# EAGLE design BabyPC (EAGLE 9.2.0)
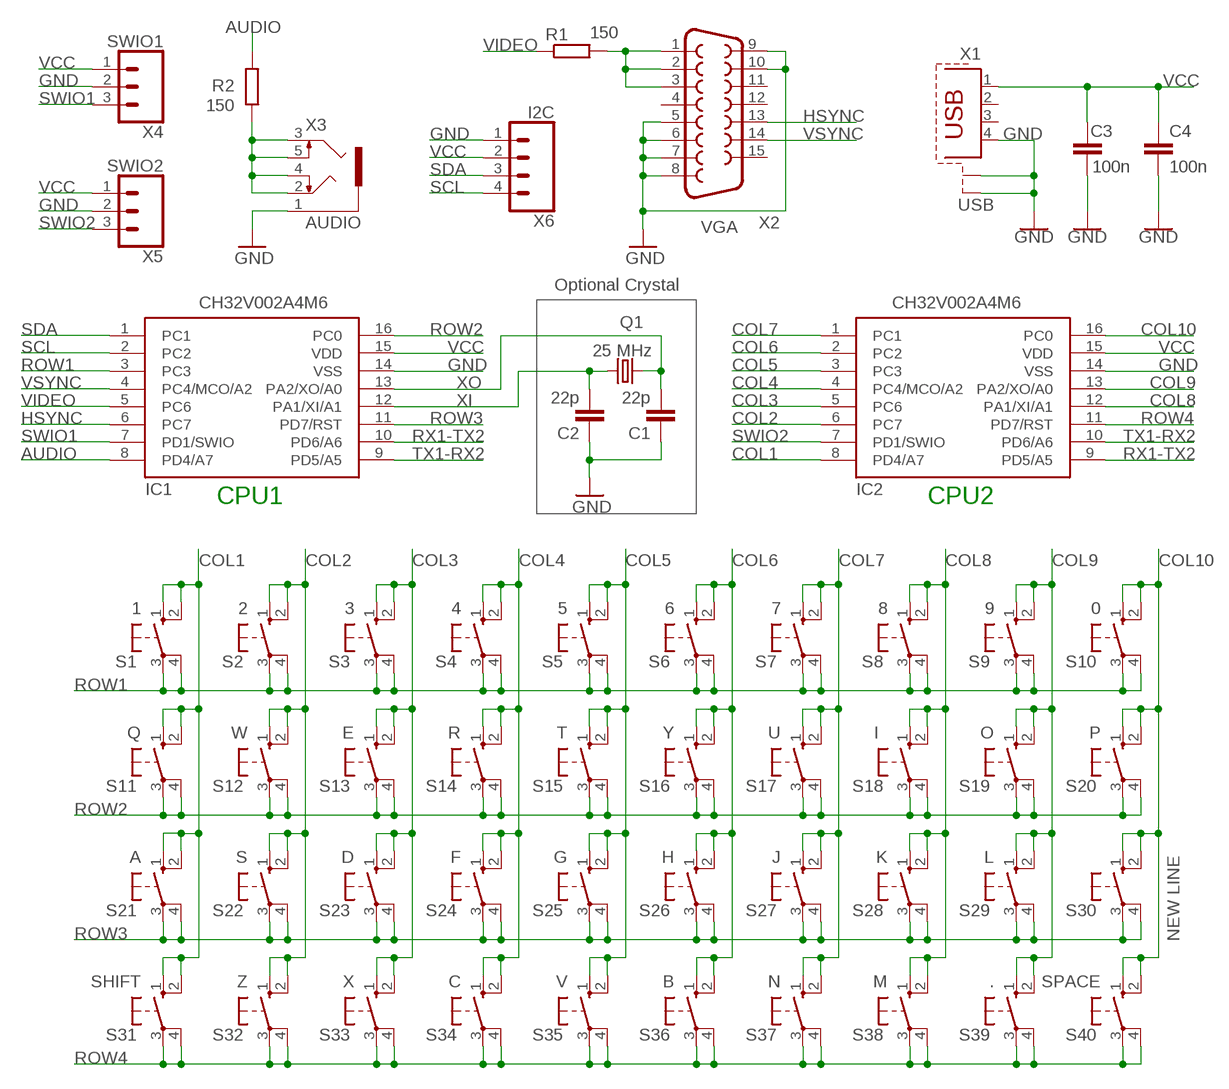
[diagram p0: schematic, sheet 1]

## Parts
C1  22p  C-EU050-024X044  [C050-024X044]
C2  22p  C-EU050-024X044  [C050-024X044]
C3  100n  C-EU050-024X044  [C050-024X044]
C4  100n  C-EU050-024X044  [C050-024X044]
IC1  CH32V002A4M6  [SOP16]
IC2  CH32V002A4M6  [SOP16]
Q1  25 MHz  CRYSTALHC49U-V  [HC49U-V]
R1  150  R-EU_0204/7  [0204/7]
R2  150  R-EU_0204/7  [0204/7]
S1  1  10-XX  [B3F-10XX]
S2  2  10-XX  [B3F-10XX]
S3  3  10-XX  [B3F-10XX]
S4  4  10-XX  [B3F-10XX]
S5  5  10-XX  [B3F-10XX]
S6  6  10-XX  [B3F-10XX]
S7  7  10-XX  [B3F-10XX]
S8  8  10-XX  [B3F-10XX]
S9  9  10-XX  [B3F-10XX]
S10  0  10-XX  [B3F-10XX]
S11  Q  10-XX  [B3F-10XX]
S12  W  10-XX  [B3F-10XX]
S13  E  10-XX  [B3F-10XX]
S14  R  10-XX  [B3F-10XX]
S15  T  10-XX  [B3F-10XX]
S16  Y  10-XX  [B3F-10XX]
S17  U  10-XX  [B3F-10XX]
S18  I  10-XX  [B3F-10XX]
S19  O  10-XX  [B3F-10XX]
S20  P  10-XX  [B3F-10XX]
S21  A  10-XX  [B3F-10XX]
S22  S  10-XX  [B3F-10XX]
S23  D  10-XX  [B3F-10XX]
S24  F  10-XX  [B3F-10XX]
S25  G  10-XX  [B3F-10XX]
S26  H  10-XX  [B3F-10XX]
S27  J  10-XX  [B3F-10XX]
S28  K  10-XX  [B3F-10XX]
S29  L  10-XX  [B3F-10XX]
S30  NEW LINE  10-XX  [B3F-10XX]
S31  SHIFT  10-XX  [B3F-10XX]
S32  Z  10-XX  [B3F-10XX]
S33  X  10-XX  [B3F-10XX]
S34  C  10-XX  [B3F-10XX]
S35  V  10-XX  [B3F-10XX]
S36  B  10-XX  [B3F-10XX]
S37  N  10-XX  [B3F-10XX]
S38  M  10-XX  [B3F-10XX]
S39  .  10-XX  [B3F-10XX]
S40  SPACE  10-XX  [B3F-10XX]
X1  USB  PN61729-S  [PN61729-S]
X2  VGA  F15HDH  [HDF15H]
X3  AUDIO  1503_09  [1503_09]
X4  SWIO1  CONN_03LONGPADS  [1X03_LONGPADS]
X5  SWIO2  CONN_03LONGPADS  [1X03_LONGPADS]
X6  I2C  CONN_04LONGPADS  [1X04_LONGPADS]

## Nets
AUDIO: IC1.8(PD4/A7) R2.2
COL1: IC2.8(PD4/A7) S1.1(S) S1.2(S1) S11.1(S) S11.2(S1) S21.1(S) S21.2(S1) S31.1(S) S31.2(S1)
COL2: IC2.6(PC7) S2.1(S) S2.2(S1) S12.1(S) S12.2(S1) S22.1(S) S22.2(S1) S32.1(S) S32.2(S1)
COL3: IC2.5(PC6) S3.1(S) S3.2(S1) S13.1(S) S13.2(S1) S23.1(S) S23.2(S1) S33.1(S) S33.2(S1)
COL4: IC2.4(PC4/MCO/A2) S4.1(S) S4.2(S1) S14.1(S) S14.2(S1) S24.1(S) S24.2(S1) S34.1(S) S34.2(S1)
COL5: IC2.3(PC3) S5.1(S) S5.2(S1) S15.1(S) S15.2(S1) S25.1(S) S25.2(S1) S35.1(S) S35.2(S1)
COL6: IC2.2(PC2) S6.1(S) S6.2(S1) S16.1(S) S16.2(S1) S26.1(S) S26.2(S1) S36.1(S) S36.2(S1)
COL7: IC2.1(PC1) S7.1(S) S7.2(S1) S17.1(S) S17.2(S1) S27.1(S) S27.2(S1) S37.1(S) S37.2(S1)
COL8: IC2.12(PA1/XI/A1) S8.1(S) S8.2(S1) S18.1(S) S18.2(S1) S28.1(S) S28.2(S1) S38.1(S) S38.2(S1)
COL9: IC2.13(PA2/XO/A0) S9.1(S) S9.2(S1) S19.1(S) S19.2(S1) S29.1(S) S29.2(S1) S39.1(S) S39.2(S1)
COL10: IC2.16(PC0) S10.1(S) S10.2(S1) S20.1(S) S20.2(S1) S30.1(S) S30.2(S1) S40.1(S) S40.2(S1)
GND: C1.1 C2.1 C3.1 C4.2 IC1.14(VSS) IC2.14(VSS) X1.4 X1.S1 X1.S2 X2.5 X2.6 X2.7 X2.8 X2.9 X2.10 X3.1 X4.2 X5.2 X6.1
HSYNC: IC1.6(PC7) X2.13
N$7: R2.1 X3.2 X3.3 X3.4 X3.5
N$14: R1.2 X2.1 X2.2 X2.3
ROW1: IC1.3(PC3) S1.3(P) S1.4(P1) S2.3(P) S2.4(P1) S3.3(P) S3.4(P1) S4.3(P) S4.4(P1) S5.3(P) S5.4(P1) S6.3(P) S6.4(P1) S7.3(P) S7.4(P1) S8.3(P) S8.4(P1) S9.3(P) S9.4(P1) S10.3(P) S10.4(P1)
ROW2: IC1.16(PC0) S11.3(P) S11.4(P1) S12.3(P) S12.4(P1) S13.3(P) S13.4(P1) S14.3(P) S14.4(P1) S15.3(P) S15.4(P1) S16.3(P) S16.4(P1) S17.3(P) S17.4(P1) S18.3(P) S18.4(P1) S19.3(P) S19.4(P1) S20.3(P) S20.4(P1)
ROW3: IC1.11(PD7/RST) S21.3(P) S21.4(P1) S22.3(P) S22.4(P1) S23.3(P) S23.4(P1) S24.3(P) S24.4(P1) S25.3(P) S25.4(P1) S26.3(P) S26.4(P1) S27.3(P) S27.4(P1) S28.3(P) S28.4(P1) S29.3(P) S29.4(P1) S30.3(P) S30.4(P1)
ROW4: IC2.11(PD7/RST) S31.3(P) S31.4(P1) S32.3(P) S32.4(P1) S33.3(P) S33.4(P1) S34.3(P) S34.4(P1) S35.3(P) S35.4(P1) S36.3(P) S36.4(P1) S37.3(P) S37.4(P1) S38.3(P) S38.4(P1) S39.3(P) S39.4(P1) S40.3(P) S40.4(P1)
RX1-TX2: IC1.10(PD6/A6) IC2.9(PD5/A5)
SCL: IC1.2(PC2) X6.4
SDA: IC1.1(PC1) X6.3
SWIO1: IC1.7(PD1/SWIO) X4.3
SWIO2: IC2.7(PD1/SWIO) X5.3
TX1-RX2: IC1.9(PD5/A5) IC2.10(PD6/A6)
VCC: C3.2 C4.1 IC1.15(VDD) IC2.15(VDD) X1.1 X4.1 X5.1 X6.2
VIDEO: IC1.5(PC6) R1.1
VSYNC: IC1.4(PC4/MCO/A2) X2.14
XI: C2.2 IC1.12(PA1/XI/A1) Q1.2
XO: C1.2 IC1.13(PA2/XO/A0) Q1.1
Unconnected: X1.2 X1.3 X2.4 X2.11 X2.12 X2.15

## Notes on the sheet
- Optional Crystal
- CPU1 | CPU2

## Library data of the parts
C1-C4 = rcl:C-EU: CAPACITOR, European symbol; SPICEPREFIX: C
IC1 IC2 = CH32V:CH32V002A4M6
Q1 = crystal:CRYSTAL: CRYSTAL; OC_FARNELL: 1666969; OC_NEWARK: unknown
R1 R2 = rcl:R-EU_: RESISTOR, European symbol; SPICEPREFIX: R
S1-S40 = switch-omron2:10-XX: OMRON SWITCH; MPN: B3F-1000; OC_FARNELL: 176432; OC_NEWARK: 36M3542
X1 = con-berg:PN61729-S: BERG USB connector; OC_FARNELL: unknown; OC_NEWARK: unknown
X2 = adafruit_B:F15: SUB-D HDH is also known as a 'right angle VGA' connector
X3 = con-lumberg:1503_09: Jack connectors according to JISC 6560, 3.5 mm Klinkeneinbaukupplung nach JISC 6560, 3,5 mm, 3-polig/ stereo, abgewinkelte Ausführung, mit 2 Öffnern und Lötaugen, für Leiterplatten Rückseitenmontage Source: http://www.lumberg.com/Produkte/PDFs/1503_09.pdf; OC_FARNELL: 1243244; OC_NEWARK: unknown
X4 X5 = SparkFun-Connectors:CONN_03: Multi connection point. Often used as Generic Header-pin footprint for 0.1 inch spaced/style header connections On any of the 0.1 inch spaced packages, you can populate with these: Break Away Headers - Straight <https://www.sparkfun.com/products/116> (PRT-00116) Break Away Male Headers - Right Angle <https://www.sparkfun.com/products/553> (PRT-00553) Female Headers <https://www.sparkfun.com/products/115> (PRT-00115) Break Away Headers - Machine Pin <https://www.sparkfun.com/products/117> (PRT-00117) Break Away Female Headers - Swiss Machine Pin <https://www.sparkfun.com/products/743> (PRT-00743) Stackable Header - 3 Pin (Female, 0.1") <https://www.sparkfun.com/products/13875> (PRT-13875) For SCREWTERMINALS and SPRING TERMINALS visit here: Screw Terimnals on SparkFun.com <https://www.sparkfun.com/search/results?term=Screw+Terminals> (5mm/3.5mm/2.54mm spacing) This device is also useful as a general connection point to wire up your design to another part of your project. Our various solder wires solder well into these plated through hole pads. Hook-Up Wire - Assortment (Stranded, 22 AWG) <https://www.sparkfun.com/products/11375> (PRT-11375) Hook-Up Wire - Assortment (Solid Core, 22 AWG) <https://www.sparkfun.com/products/11367> (PRT-11367) View the entire wire category on our website here <https://www.sparkfun.com/categories/141> Special notes: Molex polarized connector foot print use with SKU : PRT-08232 with associated crimp pins and housings.
X6 = SparkFun-Connectors:CONN_04: Multi connection point. Often used as Generic Header-pin footprint for 0.1 inch spaced/style header connections On any of the 0.1 inch spaced packages, you can populate with these: Break Away Headers - Straight <https://www.sparkfun.com/products/116> (PRT-00116) Break Away Male Headers - Right Angle <https://www.sparkfun.com/products/553> (PRT-00553) Female Headers <https://www.sparkfun.com/products/115> (PRT-00115) Break Away Headers - Machine Pin <https://www.sparkfun.com/products/117> (PRT-00117) Break Away Female Headers - Swiss Machine Pin <https://www.sparkfun.com/products/743> (PRT-00743) For SCREWTERMINALS and SPRING TERMINALS visit here: Screw Terimnals on SparkFun.com <https://www.sparkfun.com/search/results?term=Screw+Terminals> (5mm/3.5mm/2.54mm spacing) This device is also useful as a general connection point to wire up your design to another part of your project. Our various solder wires solder well into these plated through hole pads. Hook-Up Wire - Assortment (Stranded, 22 AWG) <https://www.sparkfun.com/products/11375> (PRT-11375) Hook-Up Wire - Assortment (Solid Core, 22 AWG) <https://www.sparkfun.com/products/11367> (PRT-11367) View the entire wire category on our website here <https://www.sparkfun.com/categories/141> Special notes: Molex polarized connector foot print use with SKU : PRT-08231 with associated crimp pins and housings. 1MM SMD Version SKU: PRT-10208; PROD_ID: CONN-09696

## Board
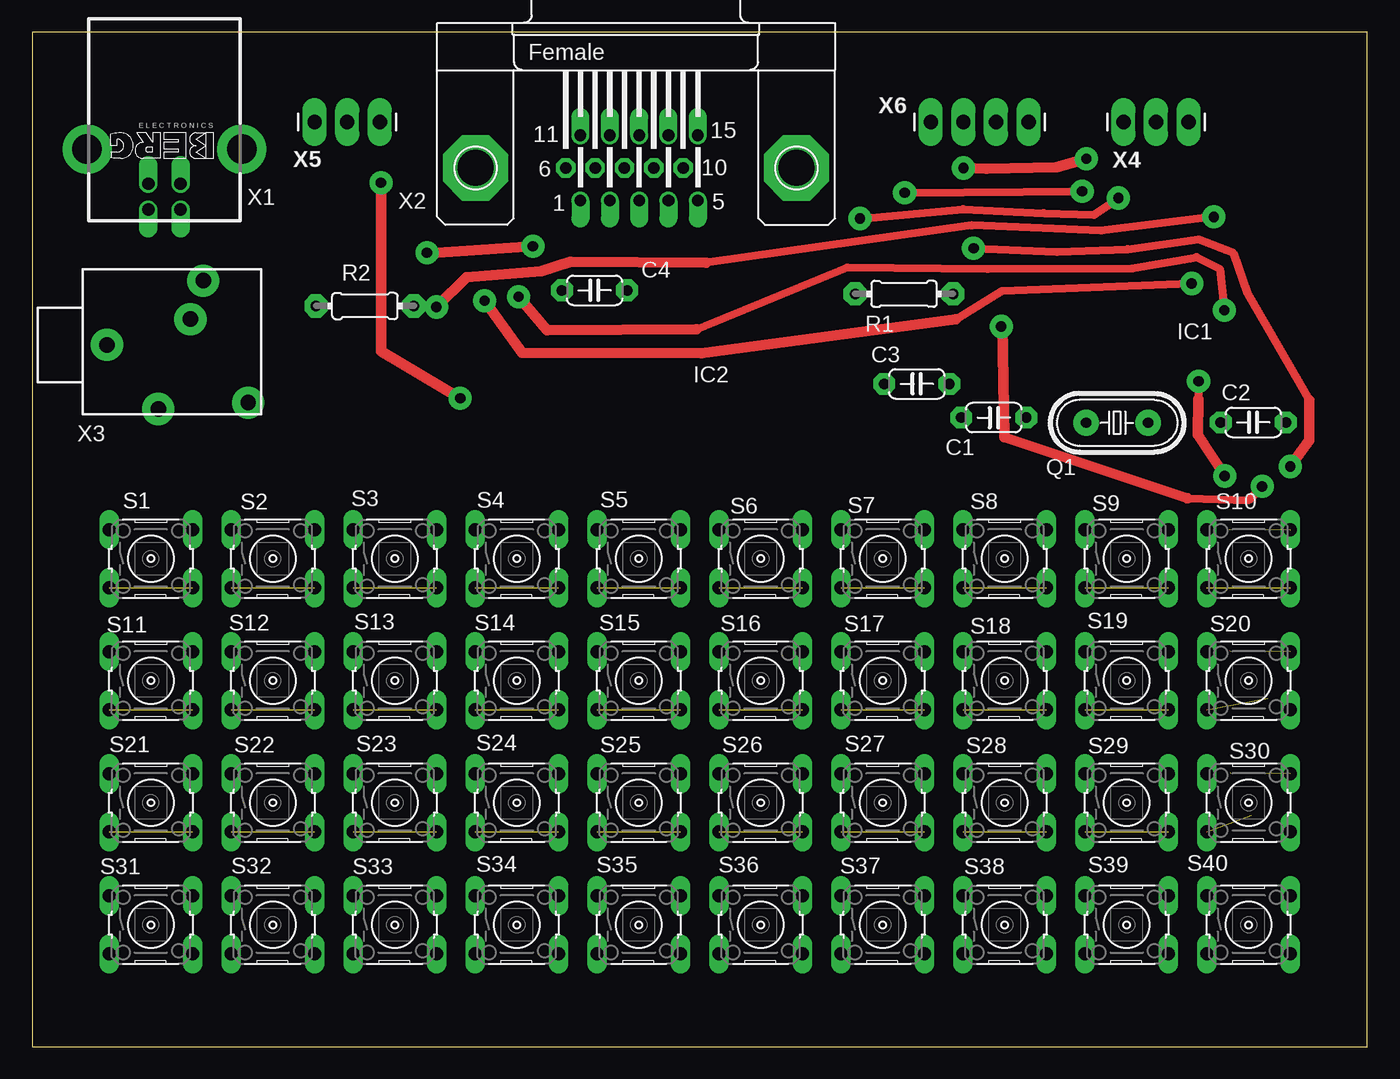
[diagram p1: board, top side]
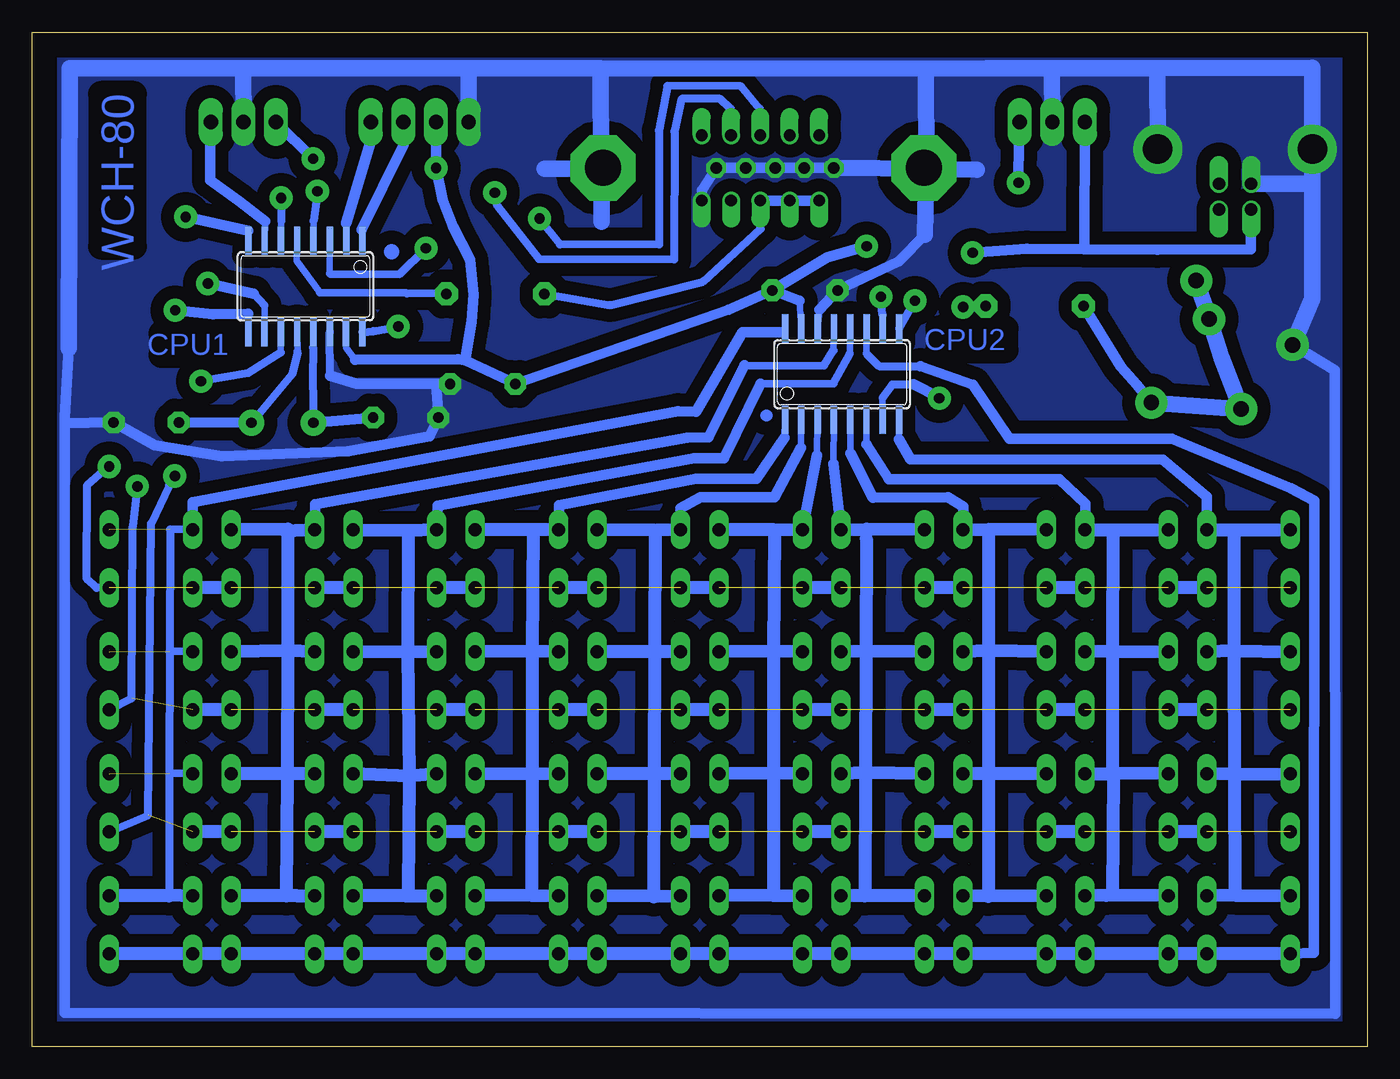
[diagram p2: board, bottom side, seen from below]

Size 104 x 79 mm. Coordinates in mm from the lower left corner, seen from the top.
Outline: 0,0 104,0 104,79 0,79 0,0
Copper layers (1*16): Top 0.035mm / dielectric 1.5mm / Bottom 0.035mm
Design rules "default": minimum track width 6mil, minimum drill 0.35mm, track to track 6mil, track to pad 6mil, pad to pad 6mil, via to via 6mil, smd to smd 6mil, copper to edge 40mil, drill to drill 6mil, minimum pad ring 10mil, minimum via ring 8mil, stop-mask expansion 4mil, vias tented up to drill 0mil, thermal gap 10mil

### Footprints (pad centres in the part's own frame; a part is rotated, then mirrored left to right if it is on the bottom)
C050-024X044 = drill 0.813 pad 1.7 octagon: 1 -2.54,0; 2 2.54,0
SOP16 = smd 0.5 x 2.2: 1 -4.445,-3.55; 2 -3.185,-3.55; 3 -1.915,-3.55; 4 -0.645,-3.55; 5 0.635,-3.55; 6 1.895,-3.55; 7 3.165,-3.55; 8 4.435,-3.55; 9 4.445,3.55; 10 3.175,3.55; 11 1.905,3.55; 12 0.635,3.55; 13 -0.635,3.55; 14 -1.905,3.55; 15 -3.175,3.55; 16 -4.445,3.55
HC49U-V = drill 0.813 pad 2: 1 -2.413,0; 2 2.413,0
0204/7 = drill 0.813 pad 1.8 octagon: 1 -3.81,0; 2 3.81,0
B3F-10XX = drill 1.016 long: 1 -3.251,2.261; 2 3.251,2.261; 3 -3.251,-2.261; 4 3.251,-2.261
PN61729-S = drill 0.95 offset: 1 1.25,4.71; 2 -1.25,4.71; 3 -1.25,2.71; 4 1.25,2.71 | drill 2.3 pad 3.81: S1 -6.02,0; S2 6.02,0
HDF15H = drill 0.9 pad 1.27 offset: 1 4.329,2.54; 2 2.043,2.54; 3 -0.243,2.54; 4 -2.529,2.54; 5 -4.815,2.54; 11 4.329,-2.54; 12 2.043,-2.54; 13 -0.243,-2.54; 14 -2.529,-2.54; 15 -4.815,-2.54 | drill 0.9 pad 1.5 octagon: 6 5.472,0; 7 3.186,0; 8 0.9,0; 9 -1.386,0; 10 -3.672,0 | drill 2.8 pad 5.08 octagon: P$1 -12.5,0; P$2 12.5,0
1503_09 = drill 1.2 pad 2.5: 1 0,-2; 2 -5,-6; 3 5,-9.5; 4 -4.5,-13; 5 2,-8.5
1X03_LONGPADS = drill 1.118 pad 1.88 long: 1 0,0; 2 2.54,0; 3 5.08,0
1X04_LONGPADS = drill 1.118 pad 1.88 long: 1 0,0; 2 2.54,0; 3 5.08,0; 4 7.62,0

### Placement (x,y rotation side)
C1  74.9,48.99 0 top
C2  95.12,48.61 180 top
C3  68.9,51.61 180 top
C4  43.81,58.9 180 top
IC1  82.72,59.2 180 bottom
IC2  40.91,52.37 0 bottom
Q1  84.5,48.58 0 top
R1  67.91,58.62 180 top
R2  25.93,57.68 0 top
S1  9.25,38 0 top
S2  18.75,38 0 top
S3  28.25,38 0 top
S4  37.75,38 0 top
S5  47.25,38 0 top
S6  56.75,38 0 top
S7  66.25,38 0 top
S8  75.75,38 0 top
S9  85.25,38 0 top
S10  94.75,38 0 top
S11  9.25,28.5 0 top
S12  18.75,28.5 0 top
S13  28.25,28.5 0 top
S14  37.75,28.5 0 top
S15  47.25,28.5 0 top
S16  56.75,28.5 0 top
S17  66.25,28.5 0 top
S18  75.75,28.5 0 top
S19  85.25,28.5 0 top
S20  94.75,28.5 0 top
S21  9.25,19 0 top
S22  18.75,19 0 top
S23  28.25,19 0 top
S24  37.75,19 0 top
S25  47.25,19 0 top
S26  56.75,19 0 top
S27  66.25,19 0 top
S28  75.75,19 0 top
S29  85.25,19 0 top
S30  94.75,19 0 top
S31  9.25,9.5 0 top
S32  18.75,9.5 0 top
S33  28.25,9.5 0 top
S34  37.75,9.5 0 top
S35  47.25,9.5 0 top
S36  56.75,9.5 0 top
S37  66.25,9.5 0 top
S38  75.75,9.5 0 top
S39  85.25,9.5 0 top
S40  94.75,9.5 0 top
X1  10.31,69.89 180 top
X2  47.04,68.43 180 top
X3  3.83,54.65 90 top
X4  85,72 0 top
X5  22,72 0 top
X6  70,72 0 top

### Tracks (layer width: path | path; a pad name or v marks a point on that pad's centre or on a via)
AUDIO  (via drill 0.8 pad 1.8)
  Top 0.61: v92.04,64.61 83.25,63.54 73.2,63.95 52.49,61.05
  Top 0.813: 52.49,61.05 41.95,61.13 39.64,60.37 33.83,59.91 v31.49,57.6
  Bottom 0.508: IC1.8 87.17,63.52
  Bottom 0.813: 87.17,63.52 v92.04,64.61 | v31.49,57.6 R2.2
COL1
  Bottom 0.508: IC2.8 36.49,47.31
  Bottom 0.813: 36.49,47.31 35.58,45.74 15.92,45.71 12.52,42.84 S1.2
  Bottom 1.016: S1.2 10.41,40.25 | 10.41,40.25 10.41,30.83 | 10.41,30.83 10.38,21.23 | 10.38,21.23 10.33,11.8 | 10.33,11.8 S31.2 | 10.38,21.23 S21.2 | 10.41,30.83 S11.2 | 10.41,40.25 S1.1 | 10.41,30.83 S11.1 | 10.38,21.23 S21.1 | 10.33,11.8 S31.1
COL2
  Bottom 0.508: IC2.6 39.03,46.91
  Bottom 0.61: 19.86,21.3 19.8,21.25 | 19.86,11.8 20.34,11.79 | 15.97,30.75 S12.1
  Bottom 0.813: 39.03,46.91 37.28,44.19 24,44.19 21.96,42.28 S2.2
  Bottom 1.016: S2.2 19.83,40.25 | 19.83,40.25 19.88,30.8 | 19.88,30.8 19.86,21.3 S22.1 | 19.86,11.8 19.8,21.25 S22.2 | S32.2 20.34,11.79 S32.1 | 19.88,30.8 S12.2 | 19.83,40.25 S2.1 | 19.88,30.8 15.97,30.75
COL3
  Bottom 0.508: IC2.5 40.28,46.2
  Bottom 0.61: 31.41,41.01 S3.2
  Bottom 0.813: 40.28,46.2 38.5,42.74 32.68,42.77 31.46,42.06 31.41,41.01
  Bottom 1.016: S3.2 29.51,40.28 | 29.51,40.28 29.52,30.83 | 29.52,30.83 29.52,21.25 | 29.52,21.25 29.53,11.7 | 29.53,11.7 S33.2 | 29.52,21.25 S23.2 | 29.52,30.83 S13.2 | S33.1 29.53,11.7 | S23.1 29.52,21.25 | S13.1 29.52,30.83 | S3.1 29.51,40.28
COL4
  Bottom 0.508: IC2.4 41.57,45.41
  Bottom 0.61: 38.98,40.3 39.03,39.57 | 39.11,21.33 39.09,21.33
  Bottom 0.813: 41.57,45.41 S4.2
  Bottom 1.016: S4.2 38.98,40.3 S4.1 | 39.03,39.57 39.06,30.78 | 39.06,30.78 39.11,21.33 S24.1 | 39.13,11.75 39.09,21.33 S24.2 | 39.13,11.75 S34.2 | 39.06,30.78 S14.2 | S14.1 39.06,30.78 | S34.1 39.13,11.75
COL5
  Bottom 0.508: IC2.3 42.87,46.04
  Bottom 0.61: 46.25,40.23 46.2,40.25
  Bottom 0.813: 42.87,46.04 S5.1
  Bottom 1.016: S5.1 46.25,40.23 | 46.27,30.78 46.2,40.25 S5.2 | 46.27,30.78 46.27,21.3 | 46.27,21.3 46.27,11.78 | 46.27,11.78 S35.1 | S25.1 46.27,21.3 | S15.1 46.27,30.78 | 46.27,11.78 S35.2 | 46.27,21.3 S25.2 | 46.27,30.78 S15.2
COL6
  Bottom 0.508: IC2.2 44.11,46.65
  Bottom 0.61: 55.42,40.2 55.47,40.2 | 55.59,11.68 55.24,11.72
  Bottom 0.813: 44.11,46.65 46.17,42.79 51.94,42.79 53.49,41.93 S6.1
  Bottom 1.016: S6.1 55.42,40.2 | 55.53,30.75 55.47,40.2 S6.2 | 55.53,30.75 55.58,21.26 | 55.58,21.26 55.59,11.68 | S36.1 55.24,11.72 S36.2 | S26.1 55.58,21.26 | S16.1 55.53,30.75 | 55.53,30.75 S16.2 | 55.58,21.26 S26.2
COL7
  Bottom 0.508: IC2.1 45.38,47.41
  Bottom 0.813: 45.38,47.41 47.59,44.24 52.29,44.22 62.96,42.16 S7.1
  Bottom 1.016: S7.1 64.99,40.25 | 64.99,40.25 65.04,30.78 | 65.04,30.78 65.04,21.23 | 65.04,21.23 65.09,11.78 | 65.09,11.78 S37.1 | S27.1 65.04,21.23 | S17.1 65.04,30.78 | 65.09,11.78 S37.2 | 65.04,21.23 S27.2 | 65.04,30.78 S17.2 | 64.99,40.25 S7.2
COL8
  Bottom 0.508: 40.3,53.97 IC2.12
  Bottom 0.61: 47.29,51.63 41.57,51.66 40.3,53.97 | 74.72,11.98 74.97,11.78 | 78.35,40.23 S8.2
  Bottom 0.813: S8.1 72.41,42.13 52.44,45.84 50.11,45.81 47.29,51.63
  Bottom 1.016: S8.1 74.72,40.18 | 74.72,40.18 74.75,30.71 | 74.75,30.71 74.64,21.07 | 74.64,21.07 74.72,11.98 | S38.1 74.97,11.78 S38.2 | S28.1 74.64,21.07 | S18.1 74.75,30.71 | 74.72,40.18 78.35,40.23 | 74.75,30.71 S18.2 | 74.64,21.07 S28.2
COL9
  Bottom 0.508: 41.57,54.22 IC2.13
  Bottom 0.61: 48.51,53.08 42.31,53.03 41.57,54.22 | 84.27,40.15 84.09,40.31 | 84.19,11.75 83.42,11.76
  Bottom 0.813: S9.1 81.96,42.23 53,47.41 51.3,47.47 48.51,53.08
  Bottom 1.016: S9.1 84.27,40.15 | 84.08,30.85 84.09,40.31 S9.2 | 84.08,30.85 84.13,21.27 | 84.13,21.27 84.19,11.75 | S39.1 83.42,11.76 S39.2 | S29.1 84.13,21.27 | S19.1 84.08,30.85 | 84.13,21.27 S29.2 | 84.08,30.85 S19.2
COL10  (3 unrouted)
  Bottom 0.508: 45.59,55.62 IC2.16
  Bottom 0.61: S10.1 93.26,40.28 93.29,30.78 | 93.29,30.78 93.31,21.28 | 93.31,21.28 93.34,11.76 93.31,11.83 | S30.1 93.31,21.28 | S20.1 93.29,30.78
  Bottom 0.813: S10.1 91.48,42.39 53.69,49.5 52.29,49.45 48.66,55.65 45.59,55.62
  Bottom 1.016: 93.31,11.83 S40.1 | 93.34,11.76 S40.2
GND
  Bottom 0.508: IC2.14 42.66,57.4
  Bottom 0.61: 80.79,52.24 IC1.14
  Bottom 0.813: C3.1 72.54,51.61 | 72.54,51.61 78.73,51.61 80.79,52.24 | X2.5 51.84,66.69 X2.10 X2.9 X2.8 X2.7 X2.6 | 42.66,57.4 C4.2 36.49,61.16 34.46,63.24 | X3.1 2.53,52.67 2.51,2.58 101.47,2.63 101.47,48.56 | 101.47,48.56 101.47,49.02 101.16,54.4 | 72.54,51.61 C1.1 73.04,47.52 79.37,46.37 89.22,45.99 94.46,46.83 C2.1 101.47,48.56
  Bottom 1.27: X6.1 70.02,76.19 | 70.02,76.19 87.58,76.19 | 87.58,76.19 101.08,76.19 101.16,54.4 | X4.2 87.58,76.19 | 70.02,76.19 59.73,76.19 | 59.73,76.19 34.38,76.14 | 34.38,76.14 29.69,76.17 24.56,76.19 | 24.56,76.19 16.35,76.19 | 16.35,76.19 X1.S1 | 24.56,76.19 X5.2 | 16.35,76.19 4.29,76.24 X1.S2 4.29,67.2 | 34.38,76.14 34.35,68.35 | 34.46,63.24 34.35,68.35 | 59.73,76.19 59.68,68.34 | 59.68,68.34 59.66,64.23 | X2.6 34.35,68.35 | 34.35,68.35 30.4,68.29 | 59.68,68.34 64.08,68.34 | X3.1 4.31,58.24 4.29,67.2 | X1.4 4.29,67.2
  pour Bottom (isolate 1.016, no thermals): 2,77 2,2 102,2 102,77
HSYNC  (via drill 0.8 pad 1.8)
  Top 0.61: v64.48,64.48 72.51,65.22 78.78,64.92 82.7,64.76 v84.6,66.08
  Bottom 0.508: 84.6,64.28 IC1.6
  Bottom 0.61: X2.13 47.34,73.04 48.79,74.77 54.53,74.82 55.19,71.34 55.16,62.45 62.88,62.48 v64.48,64.48 | v84.6,66.08 84.6,64.28
N$7
  Bottom 0.813: R2.1 19.22,52.95 17.95,51.55 X3.4
  Bottom 1.27: X3.4 X3.2 11.37,53.69 X3.5 X3.3
N$14
  Bottom 0.61: R1.2 59,57.75 51.76,59.58 47.26,63.67 X2.3
  Bottom 0.813: X2.3 X2.2 X2.1
ROW1  (via drill 0.8 pad 1.8)  (10 unrouted)
  Top 0.61: v73.32,62.17 79.83,61.89 85.34,62.1 90.85,62.86 93.54,61.82 94.66,58.67 99.46,50.34
  Top 0.813: 99.46,50.34 99.46,47.24 v97.99,45.18
  Bottom 0.508: IC1.3 80.82,60.19 | v97.99,45.18 98.16,45.11
  Bottom 0.61: S10.4 98.98,35.73 99.74,36.42 99.69,43.76 98.16,45.11 | 80.82,60.19 75.38,60.17 v73.32,62.17
  Bottom 1.016: S1.4 S2.3 | S2.4 S3.3 | S3.4 S4.3 | S4.4 S5.3 | S5.4 S6.3 | S6.4 S7.3 | S7.4 S8.3 | S8.4 S9.3 | S9.4 S10.3
ROW2  (via drill 0.8 pad 1.8)  (10 unrouted)
  Top 0.508: v75.48,56.08 75.56,56.23
  Top 0.61: 89.96,42.72 94.76,42.56 v95.8,43.63
  Top 0.813: 75.56,56.23 75.71,47.47 89.96,42.72
  Bottom 0.508: v95.8,43.63 95.83,43.55
  Bottom 0.61: S20.4 96.26,27.12 96.16,40.53 95.83,43.55 | IC1.16 77.41,55.72 v75.48,56.08
  Bottom 1.016: S11.4 S12.3 | S12.4 S13.3 | S13.4 S14.3 | S14.4 S15.3 | S15.4 S16.3 | S16.4 S17.3 | S17.4 S18.3 | S18.4 S19.3 | S19.4 S20.3
ROW3  (via drill 0.8 pad 1.8)  (10 unrouted)
  Top 0.61: v90.85,51.81 90.85,50.41
  Top 0.813: 90.85,50.41 90.8,47.64 v92.88,44.44
  Bottom 0.508: IC1.11 84.63,54.05
  Bottom 0.61: S30.4 94.96,18.03 94.73,40.73 93.34,43.68 v92.88,44.44 | 84.63,54.05 87.17,52.44 v90.85,51.81
  Bottom 1.016: S21.4 S22.3 | S22.4 S23.3 | S23.4 S24.3 | S24.4 S25.3 | S25.4 S26.3 | S26.4 S27.3 | S27.4 S28.3 | S28.4 S29.3 | S29.4 S30.3
ROW4
  Bottom 0.508: IC2.11 39.01,53.97
  Bottom 0.61: 39.01,53.97 38.04,53 34.82,53
  Bottom 0.813: 34.82,53 30.73,51.53 27.88,47.34 15.23,47.34 5.96,43.48 4.13,42.51 4.18,7.31 S31.3
  Bottom 1.016: S40.4 S40.3 S39.4 S39.3 S38.4 S38.3 S37.4 S37.3 S36.4 S36.3 S35.4 S35.3 S34.4 S34.3 S33.4 S33.3 S32.4 S32.3 S31.4 S31.3
RX1-TX2  (via drill 0.8 pad 1.8)
  Top 0.61: 71.95,56.63 75.53,58.84 v90.32,59.43
  Top 0.813: v35.25,58.08 38.17,54.05 52.14,53.99 71.95,56.63
  Bottom 0.508: 85.9,57.7 IC1.10
  Bottom 0.61: IC2.9 v35.25,58.08 | 86.73,58.64 85.9,57.7
  Bottom 0.813: v90.32,59.43 86.73,58.64
SCL
  Bottom 0.508: IC1.2 79.55,64.13
  Bottom 0.813: 79.55,64.13 77.62,70.48 X6.4
SDA
  Bottom 0.508: IC1.1 78.33,63.59
  Bottom 0.813: 78.33,63.59 75.08,70.22 X6.3
SWIO1
  Bottom 0.508: IC1.7 85.84,64.28
  Bottom 0.813: 85.84,64.28 87.93,65.86 90.14,67.46 90.14,70.38 X4.3
SWIO2  (via drill 0.8 pad 1.8)
  Top 0.813: v33.34,50.49 27.17,54.15 v27.17,67.28
  Bottom 0.508: IC2.7 37.76,50.51 | 33.37,50.56 v33.34,50.49
  Bottom 0.61: 37.76,50.51 37,51.58 35.38,51.58
  Bottom 0.813: 35.38,51.58 33.37,50.56 | v27.17,67.28 27.15,70.61 X5.3
TX1-RX2  (via drill 0.8 pad 1.8)
  Top 0.61: 51.73,55.87 63.49,60.67 74.42,60.57 85.67,60.6 90.7,61.49 92.5,60.57 v92.86,57.35
  Top 0.813: v37.89,58.39 40.1,55.77 51.73,55.87
  Bottom 0.508: IC2.10 37.76,56.99 | 87.17,57.07 IC1.9
  Bottom 0.61: 37.76,56.99 v37.89,58.39
  Bottom 0.813: v92.86,57.35 89.88,57.04 87.17,57.07
VCC  (via drill 0.8 pad 1.8)
  Top 0.508: 30.98,61.79 v30.75,61.82
  Top 0.813: v82.11,69.13 79.78,68.5 74.31,68.34 v72.54,68.42 | v39.01,62.33 30.98,61.79
  Bottom 0.508: IC1.15 79.55,54.43 78.86,53.5 | 44.24,58.08 IC2.15 | 39.16,62.27 v39.01,62.33
  Bottom 0.61: 72.54,70.71 X6.2
  Bottom 0.813: X4.1 v82.11,69.13 | 72.54,70.71 v72.54,68.42 72.03,65.93 71.22,63.85 69.87,61.26 69.61,58.54 69.77,56.46 70.29,53.44 | 78.86,53.5 70.81,53.54 70.29,53.44 | 70.29,53.44 C3.2 49.75,57.4 C4.1 | C4.1 44.24,58.08 | X1.1 9.09,62.1 16.35,62.07 22.04,62.1 | 22.04,62.1 X5.1 | 22.04,62.1 26.51,62.12 v30.75,61.82 | C4.1 42.06,61.49 39.16,62.27
VIDEO
  Bottom 0.508: 81.58,58.72 83.38,61.18 IC1.5
  Bottom 0.61: R1.1 74.8,58.67 81.58,58.72
VSYNC  (via drill 0.8 pad 1.8)
  Top 0.61: v67.96,66.49 v81.78,66.62
  Bottom 0.508: v81.78,66.62 81.81,66.34 | 82.09,64.31 IC1.4
  Bottom 0.61: X2.14 49.6,73.04 50.41,73.81 53.41,73.81 53.97,71.27 53.99,61.28 64.53,61.33 67.73,65.45 v67.96,66.49 | 81.81,66.34 82.09,64.31
XI
  Bottom 0.508: IC1.12 83.33,54.12
  Bottom 0.61: 83.33,54.12 83.76,52.34 Q1.2
  Bottom 0.813: Q1.2 C2.2
XO
  Bottom 0.508: IC1.13 82.11,54.45
  Bottom 0.61: 82.11,54.45 82.14,51.96 Q1.1
  Bottom 0.813: Q1.1 C1.2
(copper drawn outside any net)
  shapes: Bottom circle x2

### Text on the board
Bottom: WCH-80 | CPU2 | CPU1
Document: GND | GND | SDA | GND | VCC | SWIO2 | VCC | SCL | VCC | SWIO1